# EAGLE design emonDCmini v0.5 (EAGLE 7.7.0)
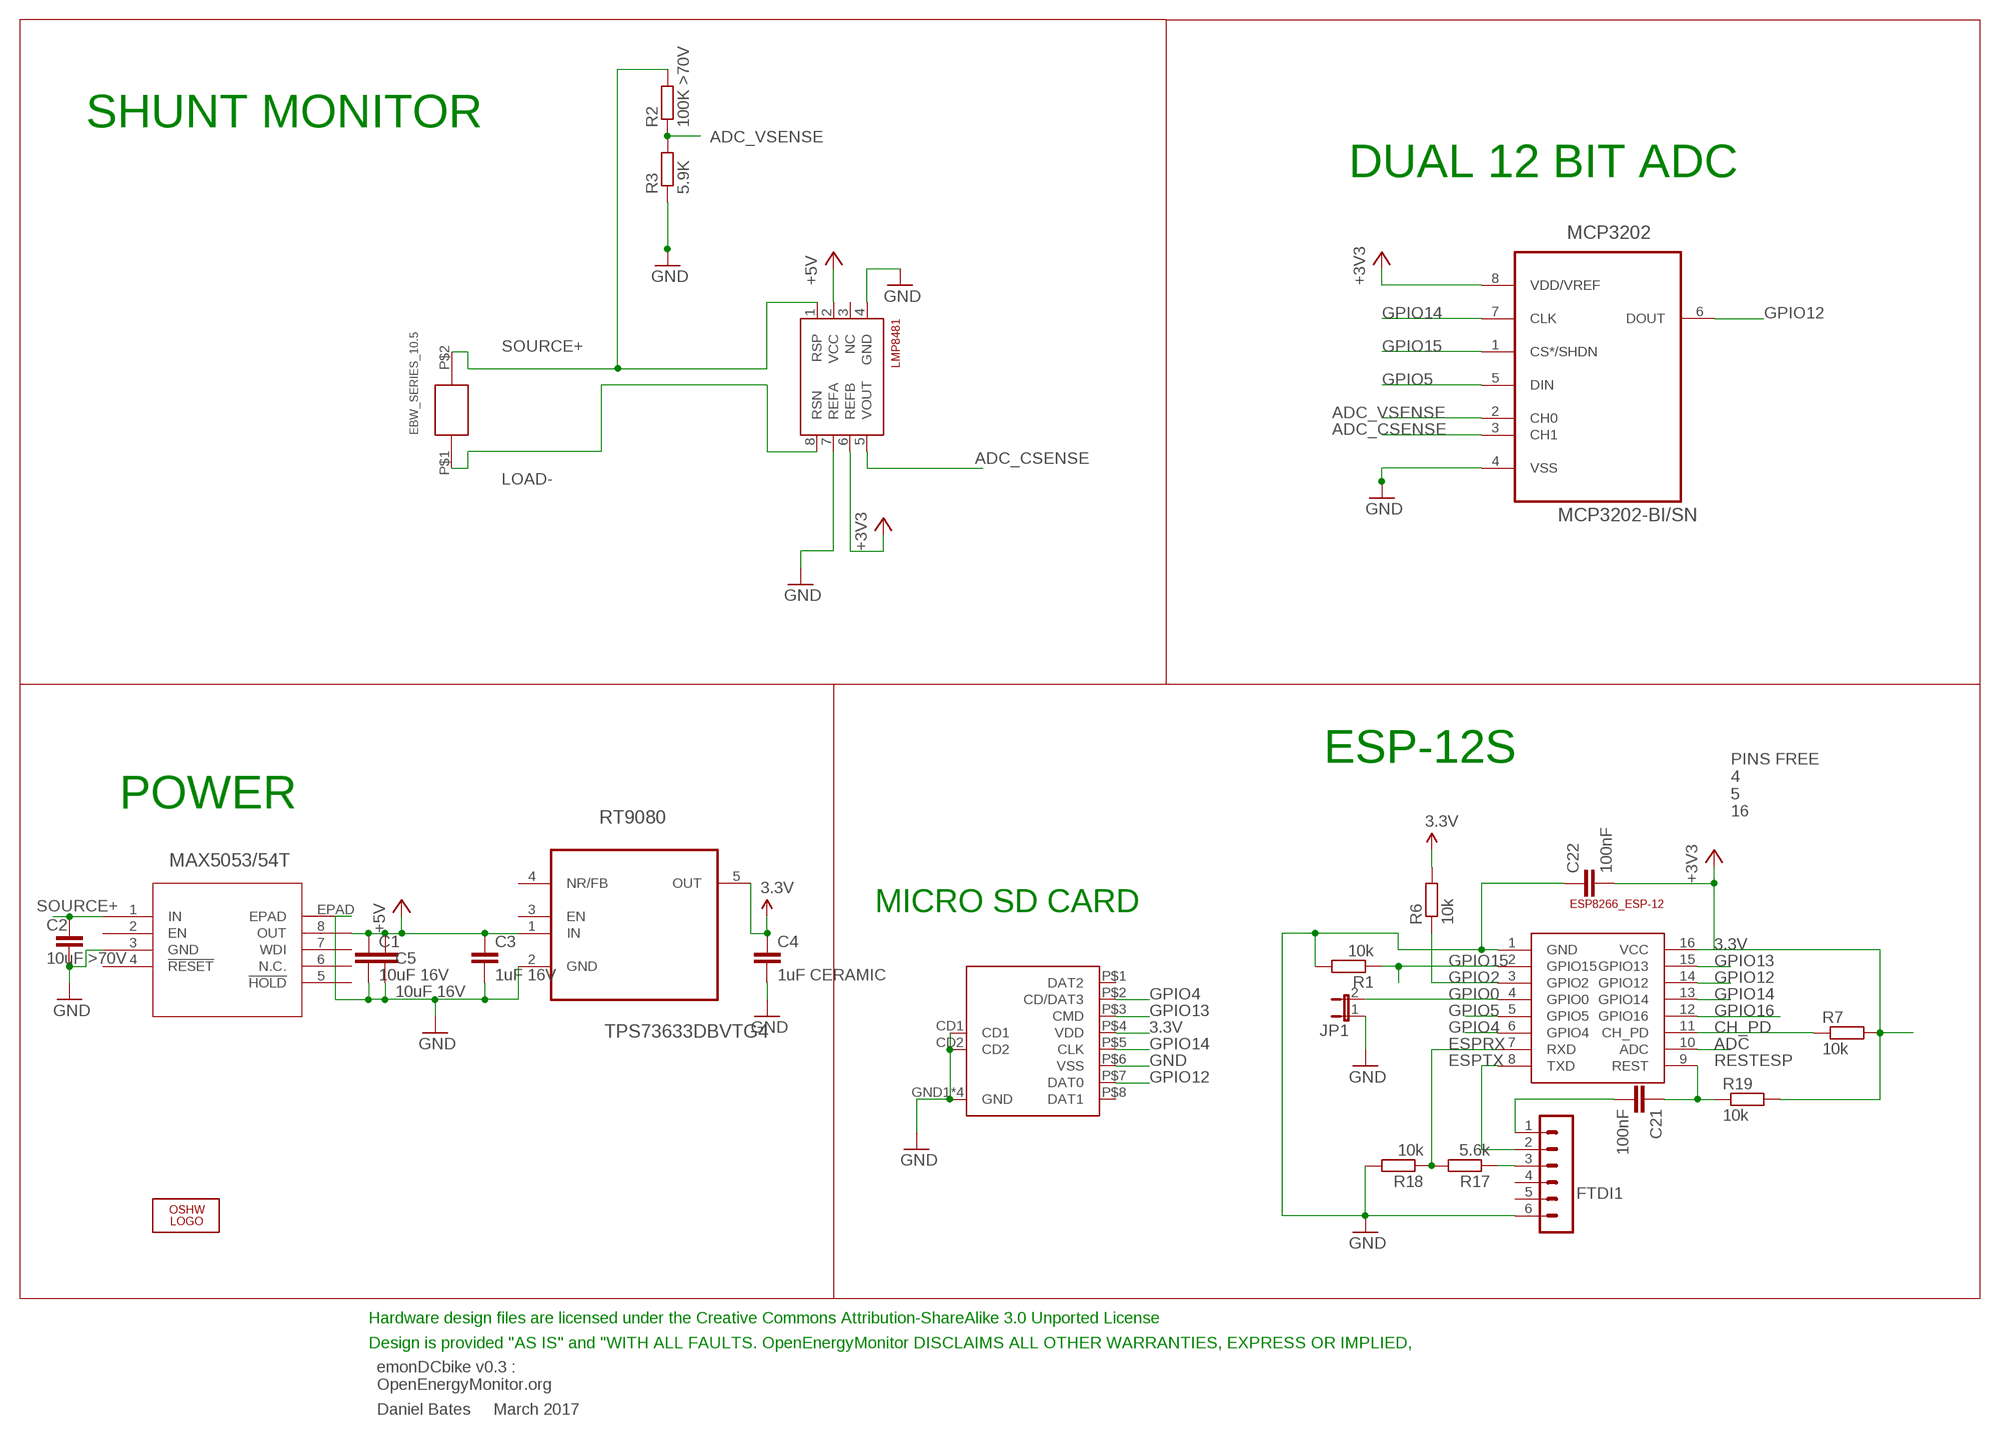
[diagram p0: schematic, sheet 1]

## Parts
C1  10uF 16V  C-EUC0603  [C0603]
C2  10uF >70V  C-EUC0603  [C0603]
C3  1uF 16V  C-EUC0603  [C0603]
C4  1uF CERAMIC  C-EUC0603  [C0603]
C5  10uF 16V  C-EUC0603  [C0603]
C21  100nF  C-EUC0603  [C0603]
C22  100nF  C-EUC0603  [C0603]
EBW_SERIES_10.5  EBW_SERIES_10.5MM  [EBW_SERIES_10.5MM]
ESP-12  ESP8266_ESP-12  [ESP8266-ESP12]
FTDI1  FTDI-ESP  MA06-1  [MA06-1]
JP1  JP1E  [JP1]
LMP8481  LMP8481-H  LMP8481LMP8481-H  [S-PDSO-G08]
LOGO1  OSHW_LOGO_6MILX0200-NT  [OSHW_6X200_NOTEXT]
MAX5053  MAX5023TASA-T21-0111D_SBE-14-L  [21-0111D_SBE-14-L]
MCP3202  MCP3202-BI/SN  [SOIC127P600X175-8N]
R1  10k  R-EU_R0603  [R0603]
R2  100K >70V  R-EU_R0603  [R0603]
R3  5.9K  R-EU_R0603  [R0603]
R6  10k  R-EU_R0603  [R0603]
R7  10k  R-EU_R0603  [R0603]
R17  5.6k  R-EU_R0603  [R0603]
R18  10k  R-EU_R0603  [R0603]
R19  10k  R-EU_R0603  [R0603]
RT9080  TPS73633DBVTG4  [SOT95P280X145-5N]
U$2  MOLEX_MICRO_SD_1040310811  [MOLEX_MICROSD_EXPOSED]

## Nets
3.3V: C4.1 C22.2 ESP-12.16(VCC) LMP8481.6(REFB) MCP3202.8(VDD/VREF) R6.2 R7.2 R19.2 RT9080.5(OUT) U$2.P$4(VDD) ; supply symbol labelled +3V3
+5V: C1.1 C3.1 C5.1 MAX5053.8(OUT) RT9080.1(IN)
ADC: ESP-12.10(ADC)
ADC_CSENSE: LMP8481.5(VOUT) MCP3202.3(CH1)
ADC_VSENSE: MCP3202.2(CH0) R2.1 R3.2
CH_PD: ESP-12.11(CH_PD) R7.1
ESPRX: ESP-12.7(RXD) R17.2 R18.1
ESPTX: ESP-12.8(TXD) FTDI1.2
GND [thin_power]: C1.2 C2.2 C3.2 C4.2 C5.2 C22.1 ESP-12.1(GND) FTDI1.6 JP1.1 LMP8481.4(GND) LMP8481.7(REFA) MAX5053.3(GND) MAX5053.EPAD MCP3202.4(VSS) R1.2 R3.1 R18.2 RT9080.2(GND) U$2.CD1 U$2.CD2 U$2.GND1(GND) U$2.GND2(GND) U$2.GND3(GND) U$2.GND4(GND) U$2.P$6(VSS)
GPIO0: ESP-12.4(GPIO0) JP1.2
GPIO2: ESP-12.3(GPIO2) R6.1
GPIO4: ESP-12.6(GPIO4) U$2.P$2(CD/DAT3)
GPIO5: ESP-12.5(GPIO5) MCP3202.5(DIN)
GPIO12: ESP-12.14(GPIO12) MCP3202.6(DOUT) U$2.P$7(DAT0)
GPIO13: ESP-12.15(GPIO13) U$2.P$3(CMD)
GPIO14: ESP-12.13(GPIO14) MCP3202.7(CLK) U$2.P$5(CLK)
GPIO15: ESP-12.2(GPIO15) MCP3202.1(CS*/SHDN) R1.1
GPIO16: ESP-12.12(GPIO16)
LOAD- [power]: EBW_SERIES_10.5.P$1 LMP8481.8(RSN)
N$36: FTDI1.3 R17.1
RESTESP: C21.1 ESP-12.9(REST) R19.1
RST: C21.2 FTDI1.1
SOURCE+ [power]: C2.1 EBW_SERIES_10.5.P$2 LMP8481.1(RSP) MAX5053.1(IN) R2.2
Unconnected: FTDI1.4 FTDI1.5 LMP8481.2(VCC) LMP8481.3(NC) MAX5053.2(EN) MAX5053.4(!RESET) MAX5053.5(!HOLD) MAX5053.6(N.C.) MAX5053.7(WDI) RT9080.3(EN) RT9080.4(NR/FB) U$2.P$1(DAT2) U$2.P$8(DAT1)

## Notes on the sheet
- SHUNT MONITOR
- DUAL 12 BIT ADC
- ESP-12S
- POWER
- PINS FREE
  4
  5
  16
- MICRO SD CARD
- Hardware design files are licensed under the Creative Commons Attribution-ShareAlike 3.0 Unported License
- Design is provided "AS IS" and "WITH ALL FAULTS. OpenEnergyMonitor DISCLAIMS ALL OTHER WARRANTIES, EXPRESS OR IMPLIED,
- emonDCbike v0.3 :
  OpenEnergyMonitor.org
- Daniel Bates     March 2017

## Library data of the parts
C1-C5 C21 C22 = rcl:C-EU: CAPACITOR, European symbol
EBW_SERIES_10.5 = EBW series shunt:EBW_SERIES_10.5MM
ESP-12 = ESP8266-ESP12:ESP8266_ESP-12
FTDI1 = JeeLabs:MA06-1: PIN HEADER
JP1 = jumper:JP1E: JUMPER
LMP8481 = lmp8481b:LMP8481: LMP8481MM-H/NOPB 100V/V
LOGO1 = ohw-logo:OSHW_LOGO_6MIL; OC_FARNELL: unknown
MAX5053 = MAX5053:MAX5023TASA-T: VOLTAGE REGULATOR 3.3V; MANUFACTURER_PART_NUMBER: max5023tasat; VENDOR: MAXIM
MCP3202 = Microchip-MCP3202-BI_SN:MCP3202-BI/SN: IC ADC 12BIT 2.7V 2CH SPI,SOIC-8; MPN: MCP3202-BI/SN; OC_FARNELL: 1196803; OC_NEWARK: 96K3721; PACKAGE: SOIC-8; SUPPLIER: Microchip
R1 R6 R7 R17-R19 = rcl:R-EU_: RESISTOR, European symbol
R2 = rcl:R-EU_: RESISTOR, European symbol; MPN: MCWR06X1003FTL
R3 = rcl:R-EU_: RESISTOR, European symbol; MPN: MCWR06X5901FTL
RT9080 = TSOT-23-5 REGULATOR 3.3v:TPS73633DBVTG4: Low-Dropout Regulator; MPN: TPS73633DBVTG4; OC_FARNELL: 1207346; OC_NEWARK: 62M0776; PACKAGE: SOT-5; SUPPLIER: TEXAS INSTRUMENTS
U$2 = MOLEX MICRO SD [exposed pins]:MOLEX_MICRO_SD_1040310811

## Net classes
1 power: width 1.016 mm
2 thin_power: width 0.254 mm

## Board
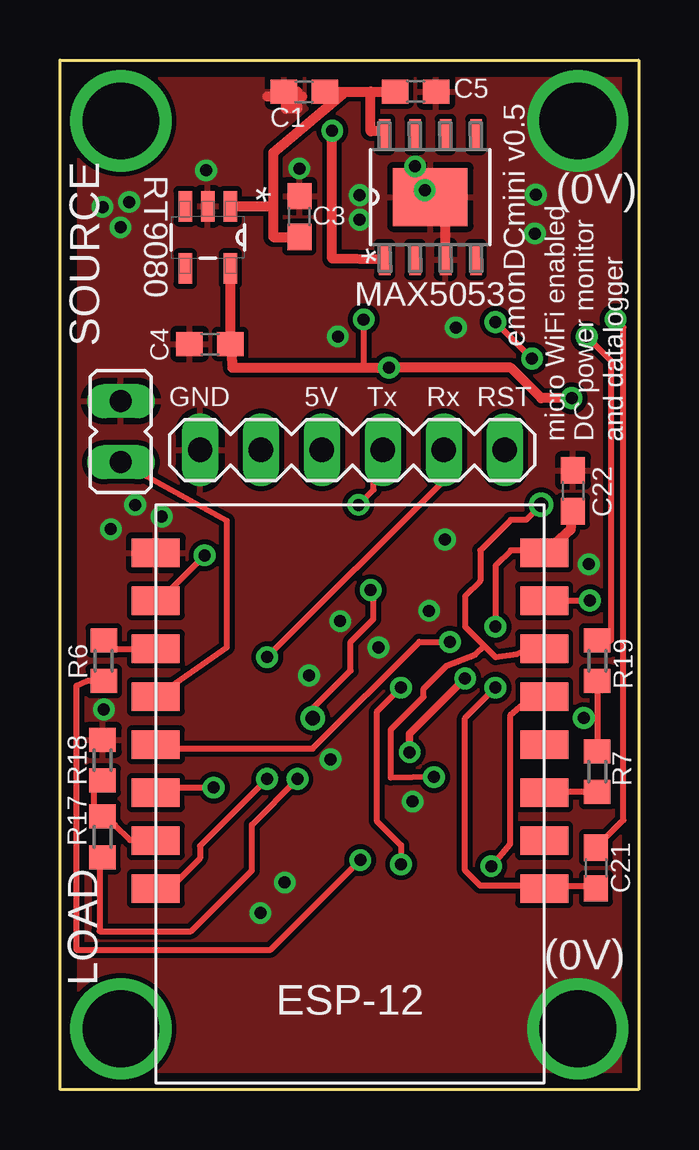
[diagram p1: board, top side]
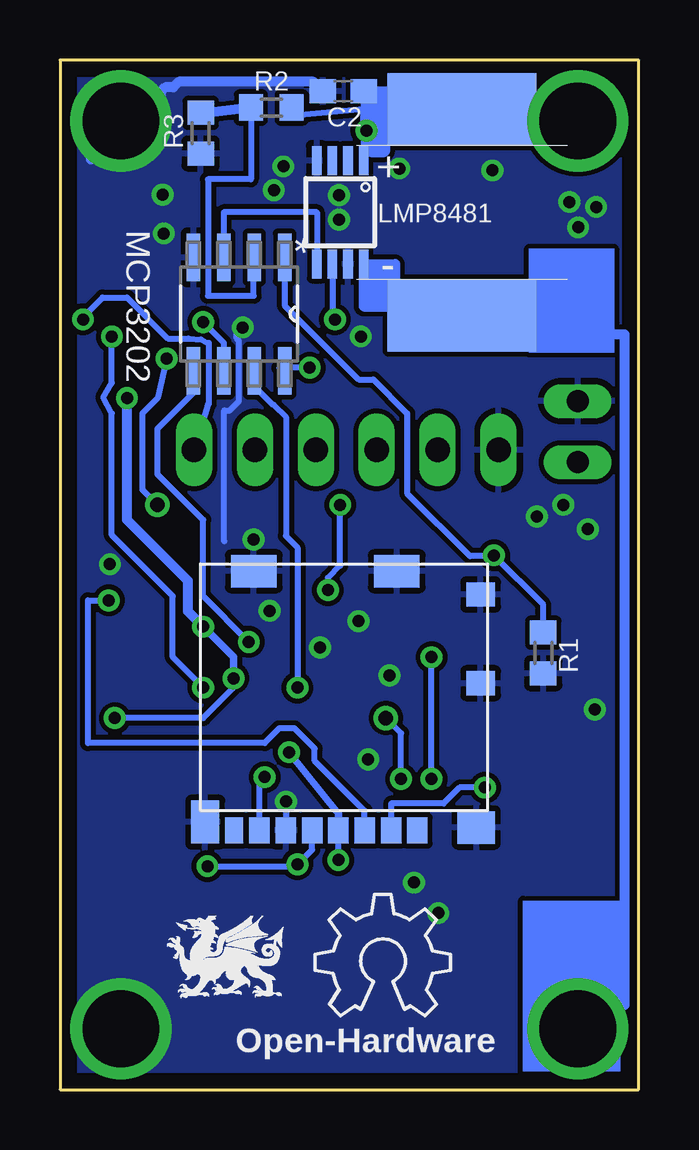
[diagram p2: board, bottom side, seen from below]

Size 24.13 x 42.93 mm. Coordinates in mm from the lower left corner, seen from the top.
Outline: 0,42.93 24.13,42.93 24.13,0 0,0 0,42.93
Copper layers (1*16): Top 0.035mm / dielectric 1.5mm / Bottom 0.035mm
Design rules "default *": minimum track width 10mil, minimum drill 24mil, track to track 8mil, track to pad 8mil, pad to pad 8mil, via to via 8mil, smd to smd 8mil, copper to edge 25mil, drill to drill 8mil, minimum pad ring 10mil, minimum via ring 8mil, stop-mask expansion 4mil, vias tented up to drill 0mil, thermal gap 10mil

### Footprints (pad centres in the part's own frame; a part is rotated, then mirrored left to right if it is on the bottom)
C0603 = smd 1.1 x 1: 1 -0.85,0; 2 0.85,0
EBW_SERIES_10.5MM = smd 3 x 6.2: P$1 -4.3,0; P$2 4.3,0
ESP8266-ESP12 = smd 2 x 1.2: 1 16.2,2; 2 16.2,4; 3 16.2,6; 4 16.2,8; 5 16.2,10; 6 16.2,12; 7 16.2,14; 8 16.2,16; 9 0,16; 10 0,14; 11 0,12; 12 0,10; 13 0,8; 14 0,6; 15 0,4; 16 0,2
MA06-1 = drill 1.016 long: 1 0,0; 2 2.54,0; 3 5.08,0; 4 7.62,0; 5 10.16,0; 6 12.7,0
JP1 = drill 0.914 long: 1 0,-1.27; 2 0,1.27
S-PDSO-G08 = smd 0.4 x 1.2: 1 -0.975,-2.157; 2 -0.325,-2.157; 3 0.325,-2.157; 4 0.975,-2.157; 5 0.975,2.157; 6 0.325,2.157; 7 -0.325,2.157; 8 -0.975,2.157
21-0111D_SBE-14-L = smd 1.295 x 0.483: 1 -2.603,1.905; 2 -2.603,0.635; 3 -2.603,-0.635; 4 -2.603,-1.905; 5 2.603,-1.905; 6 2.603,-0.635; 7 2.603,0.635; 8 2.603,1.905 | smd 2.413 x 3.099: EPAD 0,0
SOIC127P600X175-8N = smd 1.981 x 0.559: 1 -2.362,1.905; 2 -2.362,0.635; 3 -2.362,-0.635; 4 -2.362,-1.905; 5 2.362,-1.905; 6 2.362,-0.635; 7 2.362,0.635; 8 2.362,1.905
R0603 = smd 1 x 1.1: 1 -0.85,0; 2 0.85,0
SOT95P280X145-5N = smd 1.27 x 0.559: 1 -1.295,0.94; 2 -1.295,0; 3 -1.295,-0.94; 4 1.295,-0.94; 5 1.295,0.94
MOLEX_MICROSD_EXPOSED = smd 1.195 x 1.005: CD1 5.349,0.435; CD2 5.349,4.135 | smd 1.907 x 1.348: GND1 -4.112,5.104; GND2 1.853,5.104 | smd 1.17 x 1.793: GND3 -6.134,-5.352 | smd 1.551 x 1.348: GND4 5.167,-5.577 | smd 0.851 x 1.092: P$1 2.707,-5.703; P$2 1.617,-5.703; P$3 0.522,-5.699; P$4 -0.586,-5.701; P$5 -1.676,-5.703; P$6 -2.769,-5.703; P$7 -3.875,-5.701 | smd 0.749 x 1.092: P$8 -4.935,-5.701

### Placement (x,y rotation side)
C1  10.19,41.61 180 top
C2  12.32,41.63 180 bottom
C3  9.98,36.4 90 top
C4  6.25,31.08 180 top
C5  14.83,41.61 0 top
C21  22.35,9.25 90 top
C22  21.39,24.97 270 top
EBW_SERIES_10.5  7.37,36.58 90 bottom
ESP-12  20.19,24.38 180 top
FTDI1  18.54,26.67 180 top
JP1  2.54,27.43 180 top
LMP8481  12.45,36.58 180 bottom
LOGO1  13.5,3.07 0 bottom
MAX5053  15.44,37.21 90 top
MCP3202  16.66,32.33 270 bottom
R1  3.98,18.21 270 bottom
R2  15.32,40.94 0 bottom
R3  18.26,39.88 90 bottom
R6  1.83,17.88 270 top
R7  22.4,13.26 90 top
R17  1.78,10.54 90 top
R18  1.78,13.74 90 top
R19  22.4,17.88 270 top
RT9080  6.16,35.53 270 top
U$2  11.94,16.51 0 bottom
U$3  [DRAGON_LOGO_NOTEXT]  17.07,5.51 0 bottom

### Tracks (layer width: path | path; a pad name or v marks a point on that pad's centre or on a via)
3.3V  (via drill 0.5)
  Top 0.254: R19.2 22.4,15.49 | 22.4,15.49 R7.2 21.97,14.22 | v18.16,19.3 18.16,21.84 18.8,22.48 20.07,22.48 ESP-12.16 | R6.2 1.13,17.03 0.69,16.84 0.69,5.84 8.79,5.84 v12.52,9.58 | v21.84,15.49 22.4,15.49 | v12.66,32.11 12.66,30.13
  Top 0.305: v14.58,14.07 14.58,14.83 v16.89,17.15
  Top 0.406: C22.2 21.29,23.35 ESP-12.16 | v21.34,28.83 20.07,28.82 18.8,30.1 v13.72,30.1 12.7,30.1 | RT9080.5 7.1,32.4 C4.1 7.2,30.1 12.7,30.1 | 12.66,30.13 12.7,30.1
  Bottom 0.254: v13.72,30.1 14.99,30.1 MCP3202.8 | v21.84,15.49 18.16,15.49 16.89,16.76 v16.89,17.15 | v12.52,9.58 U$2.P$4 | LMP8481.6 12.77,32.22
  Bottom 0.305: v16.89,17.15 16.89,18.03 v18.16,19.3 | U$2.P$4 12.52,11.51 v14.58,14.07
  Bottom 0.406: v21.34,28.83 21.34,23.75 18.8,21.21 18.8,19.94 v18.16,19.3 | 12.77,32.22 v12.66,32.11
+5V
  Top 0.254: 11.8,41.52 C1.1 | MAX5053.8 13.4,39.95
  Top 0.406: 11.8,41.52 8.89,39.07 8.89,36.83 | 13.4,39.95 12.95,39.95 12.95,41.61 | C1.1 12.95,41.61 | 12.95,41.61 C5.1 | C3.1 8.89,35.55 8.89,36.83 | RT9080.1 8.89,36.83
ADC_CSENSE
  Bottom 0.254: MCP3202.3 17.3,36.58 13.42,36.58 LMP8481.5
ADC_VSENSE
  Bottom 0.254: 16,34.7 MCP3202.2 16.05,34.7 16.05,33.1 17.96,33.1 17.96,37.95 16.17,37.95 R2.1
  Bottom 0.406: R2.1 18.22,40.69 R3.2
CH_PD
  Top 0.254: R7.1 20.32,12.41 ESP-12.11
ESPRX
  Top 0.254: 4.11,10.38 arc90 ESP-12.7 | 3.56,10.41 3.97,10.41 ESP-12.7 | 1.9,11.37 R17.2 | R18.1 1.75,12.79 1.43,12.48 1.43,11.37 1.75,11.37 R17.2 | 3.56,10.41 2.92,10.41 2.29,11.05 R17.2 | 3.56,10.41 ESP-12.7
ESPTX  (via drill 0.5)
  Top 0.254: v8.64,18.03 16,25.4 FTDI1.2 | v8.64,12.95 5.84,10.16 5.84,9.65 4.57,8.38
  Top 0.305: 4.57,8.38 ESP-12.8
  Bottom 0.254: v8.64,12.95 v8.64,18.03
GND  (via drill 0.5, 3.2)
  Top 0.254: ESP-12.1 4.19,22.48 4.22,22.29
  Top 0.406: MAX5053.3 16.08,36.58 | 8.64,41.4 10.1,41.4 C1.2 9.91,41.61 9.91,40.89 9.42,40.89 9.42,41.22
  Bottom 0.254: v14.71,12.01 | v14.71,12.01 U$2.P$6 | U$2.GND3 18.01,11.22 | U$2.GND1 16,21.61 | 17.28,22.86 17.28,28.32 17.05,28.32 16.66,28.71 16.66,31.21 16.76,31.31 16.76,31.75
  Bottom 0.406: C2.2 13.55,42.01 19.18,42.01 19.41,41.78 19.74,41.78 19.94,41.58 19.94,40.01 21.16,38.79 22.84,38.79
  other vias: 16.05,22.94 10.39,17.27 19.84,37.31 1.83,15.85 3.14,24.38 11.68,19.53 9.37,8.64 15.39,19.96 11.28,13.77 13.28,18.44 4.24,23.9 16.51,31.78 9.98,38.4 14.81,38.49 12.5,37.29 11.58,31.4 21.59,2.54 21.59,40.39 22.05,21.91 15.21,37.5 6.09,38.32 12.5,36.27 8.36,7.37 2.12,23.37 19.8,35.7 1.78,36.8 2.89,37.01 2.52,35.95
  pour Top: 0.25,42.67 23.88,42.67 23.88,0.25 0.25,0.25
  pour Bottom: 0.25,42.67 23.88,42.67 23.88,0.25 0.25,0.25
GPIO0
  Top 0.254: JP1.2 6.96,23.71 6.96,18.45 ESP-12.4
GPIO2
  Top 0.254: R6.1 1.84,18.38 ESP-12.3
GPIO4  (via drill 0.5)
  Top 0.254: ESP-12.6 4.21,12.6 v6.41,12.6
  Bottom 0.254: v6.41,12.6 7.47,12.6 8.13,11.93 10.32,11.93 U$2.P$2
GPIO5  (via drill 0.5)
  Top 0.254: v16.26,18.67 14.99,18.67 10.54,14.22 4.19,14.22 ESP-12.5
  Bottom 0.254: v16.26,18.67 18.16,20.57 18.16,23.75 20.07,25.65 20.07,27.56 18.57,29.06 MCP3202.5
GPIO12  (via drill 0.5, 0.61)
  Top 0.254: 17.69,18.5 16.89,19.3 16.89,20.57 17.53,21.21 17.53,22.48 18.8,23.75 19.43,23.75 v20.07,24.38 | 17.69,18.5 18.16,18.03 19.05,18.16 20.07,18.67 ESP-12.14 | v18.16,32 v19.68,30.48 | v15.6,13.03 13.79,13.01 13.79,15.01 15.16,16.38 15.16,16.71 16.13,17.68 17.32,18.14 17.69,18.5
  Bottom 0.254: v20.07,24.38 20.7,25.02 20.7,28.19 20.07,28.83 v19.68,30.48 | v18.16,32 17.3,31.14 MCP3202.6 | U$2.P$7 15.81,12.98 15.34,12.98 v15.6,13.03
GPIO13  (via drill 0.5)
  Top 0.254: v22.1,20.4 v22.1,20.38 ESP-12.15
  Bottom 0.254: U$2.P$3 11.43,10.82 11.43,11.63 13.51,13.72 13.51,14.22 14.35,15.06 14.99,15.06 15.6,14.45 22.96,14.45 22.96,20.4 v22.1,20.4
GPIO14  (via drill 0.5)
  Top 0.254: ESP-12.13 19.69,16.38 18.77,15.6 18.77,10.24 v17.98,9.32 | v14.22,16.76 13.21,15.75 13.21,11.21 14.22,10.2 v14.22,9.4
  Bottom 0.254: v17.98,9.32 14.3,9.32 v14.22,9.4 13.61,10.01 U$2.P$5 | MCP3202.7 16.03,29.34 15.24,28.55 15.21,28.55 14.71,28.04 14.71,23.09 14.22,22.61 v14.22,16.76
GPIO15  (via drill 0.5)
  Top 0.254: ESP-12.2 4.14,20.38 v6.04,22.28
  Bottom 0.254: 6,22.24 5.95,22.19 | MCP3202.1 14.76,32.69 11.68,29.61 11.07,29.61 9.65,28.19 9.65,24.86 7.03,22.24 6,22.24 | 6,22.24 v6.04,22.28 3.98,20.22 R1.1
LOAD-  (via drill 3.2)
  Bottom 0.254: 11.43,34.29 11.47,34.33 LMP8481.8
  Bottom 0.406: LMP8481.8 10.16,34.42 10.16,33.27 7.37,33.27 EBW_SERIES_10.5.P$1 6.59,31.5 0.58,31.5 0.58,3.53 2.54,3.53 v2.54,2.54 | 11.43,34.29 11.47,34.29 11.47,32.65 10.28,32.65 10.28,32.66 10.34,32.66 10.34,34.17 11.19,34.17 11.19,34.18 11.18,34.18 11.18,32.99 10.55,32.99 10.55,32.94 10.59,32.94 10.59,33.92 10.87,33.92 10.87,33.96 10.89,33.96 10.89,33.23
N$36  (via drill 0.5, 0.61)
  Top 0.254: v12.45,24.38 13.08,25.02 13.08,26.29 FTDI1.3 | v9.91,12.95 8,11.05 8,9.14 5.46,6.6 1.65,6.6 1.65,9.78 R17.1 | v10.54,15.49 10.54,15.9 12.12,17.48 12.12,18.67 13.06,19.61 13.06,20.73 v12.95,20.83
  Bottom 0.254: v12.45,24.38 12.45,21.84 12.95,21.34 v12.95,20.83 | v10.54,15.49 9.91,14.86 v9.91,12.95
RESTESP  (via drill 0.5)
  Top 0.254: C21.1 21.97,8.51 20.7,8.51 ESP-12.9 20.07,8.51 17.53,8.51 16.89,9.14 16.89,15.49 v18.16,16.76 | R19.1 22.99,18.73 22.99,30.37 v21.97,31.39
  Bottom 0.254: v21.97,31.39 21.97,29.46 22.33,28.85 21.97,28.19 21.97,23.11 19.43,20.57 19.43,18.03 v18.16,16.76
RST  (via drill 0.5)
  Top 0.254: C21.2 23.49,11.24 23.49,31.78 v23.17,32.11
  Bottom 0.254: FTDI1.1 17.96,28.58 17.93,28.6 17.93,31.12 17.97,31.12 18.25,31.28 18.77,31.32 19.63,31.32 21.34,33.02 22.35,33.02 23.17,32.2 v23.17,32.11
SOURCE+  (via drill 0.5, 3.2)
  Top 0.406: MAX5053.1 11.35,34.65 v11.35,39.98
  Bottom 0.254: C2.1 11.47,40.87 | 11.47,40.87 11.68,40.85 | 11.68,40.85 14.14,40.62 | v11.35,39.98 11.47,40.02 | 11.47,40.02 LMP8481.1 | 11.49,40.02 11.49,40.87 11.47,40.87 | 11.49,40.02 11.49,39.94 11.43,39.88 | 11.2,40.99 11.34,40.85 11.68,40.85 | 11.47,40.02 11.49,40.02
  Bottom 0.406: 10.16,39.62 7.37,39.62 EBW_SERIES_10.5.P$2 7.37,41.63 C2.1 | 14.14,40.62 arc90 R2.2 | 2.29,40.89 2.54,40.89 v2.54,40.39
  Bottom 0.61: 10.67,41.4 10.67,39.16 11.1,39.16 11.1,40.89 11.2,40.99
  Bottom 1.016: 2.29,40.89 7.37,40.89 EBW_SERIES_10.5.P$2
(copper drawn outside any net)
  shapes: Bottom area x2

### Text on the board
bPlace: Open-Hardware
tNames: (0V) | SOURCE | emonDCmini v0.5 | GND | 5V | Tx | Rx | RST | micro WiFi enabled / DC power monitor / and datalogger | LOAD | (0V)
_tsilk: Designed in | North Wales | Made in UK
_bsilk: SMT V0.6 rev3 | emonTx | wireless energy monitoring node | SMT V0.6 rev3 | emonTx | SMT V0.6 rev3 | emonTx | Technology that helps us live within ecological limits | wireless energy monitoring node | wireless energy monitoring node | Designed in North Wales UK by Glyn Hudson & Trystan Lea | Technology that helps us live within ecological limits | Technology that helps us live within ecological limits | Designed in North Wales UK by Glyn Hudson & Trystan Lea | 165mm ant | 433Mhz | Designed in North Wales UK by Glyn Hudson & Trystan Lea | 165mm ant | 165mm ant | 433Mhz | 433Mhz | 868Mhz | 82mm ant | 82mm ant | 82mm ant | 868Mhz | 868Mhz | 78mm ant | 915Mhz | 78mm ant | 915Mhz | 78mm ant | 915Mhz | 165mm ant | 433Mhz | 82mm ant | 868Mhz | 78mm ant | 915Mhz